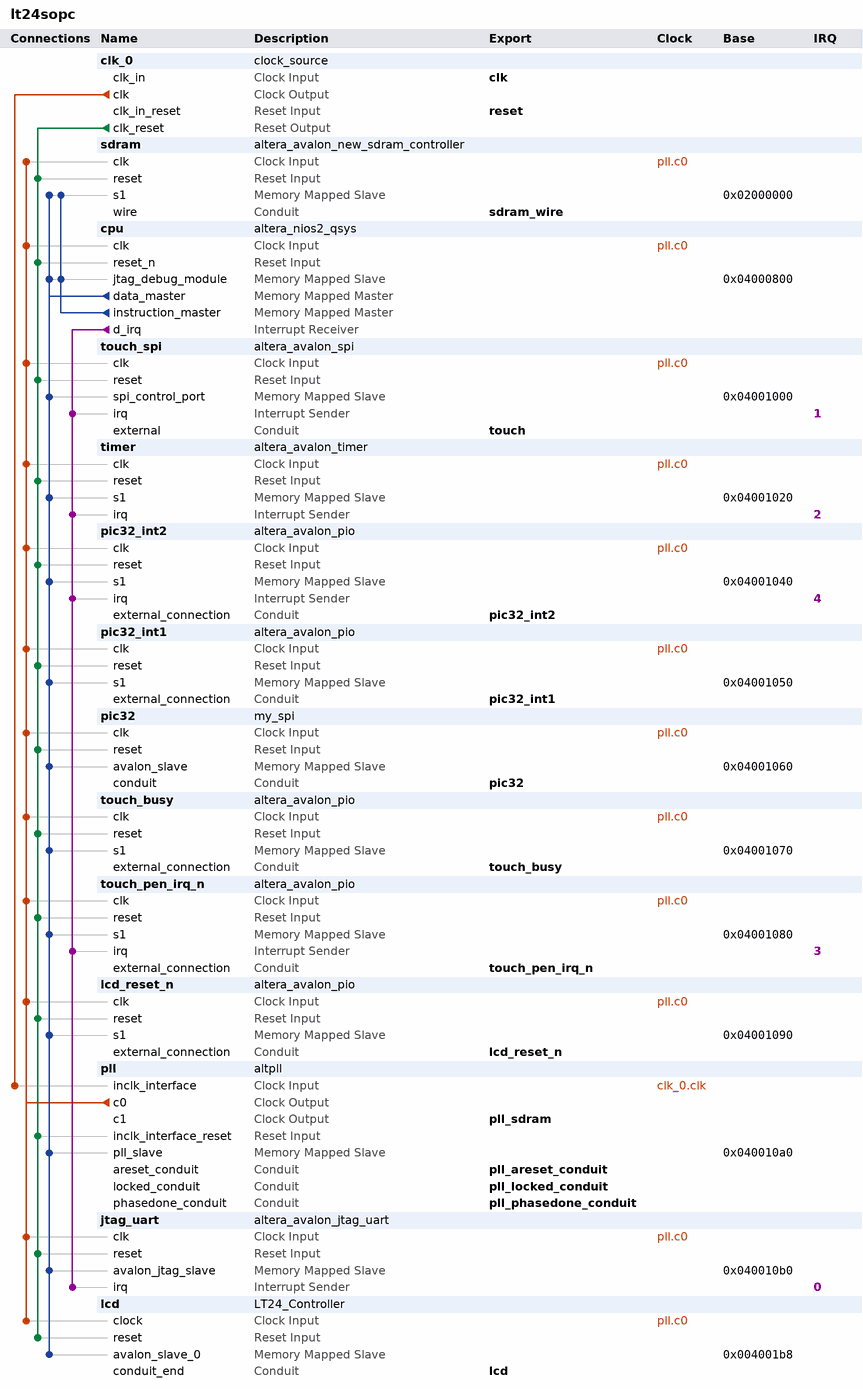
[diagram p0: system contents]
# Platform Designer (Qsys) system lt24sopc, Cyclone IV E EP4CE22F17C6
# Parameters at their usual value, and those the tool derives, are not listed.
package require -exact qsys 13.1
create_system lt24sopc
set_project_property DEVICE_FAMILY {Cyclone IV E}
set_project_property DEVICE EP4CE22F17C6

add_instance clk_0 clock_source 13.1
set_instance_parameter_value clk_0 clockFrequency 50000000

add_instance sdram altera_avalon_new_sdram_controller 13.1
set_instance_parameter_value sdram TAC 5.5
set_instance_parameter_value sdram TRCD 20.0
set_instance_parameter_value sdram TRP 20.0
set_instance_parameter_value sdram casLatency 3
set_instance_parameter_value sdram columnWidth 9
set_instance_parameter_value sdram dataWidth 16
set_instance_parameter_value sdram generateSimulationModel false
set_instance_parameter_value sdram model single_Micron_MT48LC4M32B2_7_chip
set_instance_parameter_value sdram numberOfBanks 4
set_instance_parameter_value sdram numberOfChipSelects 1
set_instance_parameter_value sdram powerUpDelay 100.0
set_instance_parameter_value sdram refreshPeriod 15.625
set_instance_parameter_value sdram rowWidth 13

add_instance cpu altera_nios2_qsys 13.1
set_instance_parameter_value cpu resetSlave sdram.s1
set_instance_parameter_value cpu mmu_TLBMissExcSlave None
set_instance_parameter_value cpu exceptionSlave sdram.s1
set_instance_parameter_value cpu breakSlave cpu.jtag_debug_module
set_instance_parameter_value cpu impl Fast
set_instance_parameter_value cpu icache_size 4096

add_instance touch_spi altera_avalon_spi 13.1
set_instance_parameter_value touch_spi clockPolarity 0
set_instance_parameter_value touch_spi dataWidth 8
set_instance_parameter_value touch_spi masterSPI true
set_instance_parameter_value touch_spi numberOfSlaves 1
set_instance_parameter_value touch_spi targetClockRate 32000

add_instance timer altera_avalon_timer 13.1
set_instance_parameter_value timer period 1
set_instance_parameter_value timer periodUnits MSEC

add_instance pic32_int2 altera_avalon_pio 13.1
set_instance_parameter_value pic32_int2 bitClearingEdgeCapReg true
set_instance_parameter_value pic32_int2 captureEdge true
set_instance_parameter_value pic32_int2 direction Input
set_instance_parameter_value pic32_int2 generateIRQ true
set_instance_parameter_value pic32_int2 irqType EDGE
set_instance_parameter_value pic32_int2 width 1

add_instance pic32_int1 altera_avalon_pio 13.1
set_instance_parameter_value pic32_int1 direction Output
set_instance_parameter_value pic32_int1 width 1

add_instance pic32 my_spi 1.0

add_instance touch_busy altera_avalon_pio 13.1
set_instance_parameter_value touch_busy direction Input
set_instance_parameter_value touch_busy width 1

add_instance touch_pen_irq_n altera_avalon_pio 13.1
set_instance_parameter_value touch_pen_irq_n captureEdge true
set_instance_parameter_value touch_pen_irq_n direction Input
set_instance_parameter_value touch_pen_irq_n edgeType FALLING
set_instance_parameter_value touch_pen_irq_n generateIRQ true
set_instance_parameter_value touch_pen_irq_n irqType EDGE
set_instance_parameter_value touch_pen_irq_n width 1

add_instance lcd_reset_n altera_avalon_pio 13.1
set_instance_parameter_value lcd_reset_n direction Output
set_instance_parameter_value lcd_reset_n width 1

add_instance pll altpll 13.1
set_instance_parameter_value pll INCLK0_INPUT_FREQUENCY 20000
set_instance_parameter_value pll CLK0_MULTIPLY_BY 2
set_instance_parameter_value pll CLK1_MULTIPLY_BY 2
set_instance_parameter_value pll CLK0_DIVIDE_BY 1
set_instance_parameter_value pll CLK1_DIVIDE_BY 1
set_instance_parameter_value pll CLK1_PHASE_SHIFT -3000
set_instance_parameter_value pll CLK1_DUTY_CYCLE 50
set_instance_parameter_value pll PORT_clk1 PORT_USED
set_instance_parameter_value pll PORT_clk2 PORT_UNUSED
set_instance_parameter_value pll PORT_clk3 PORT_UNUSED
set_instance_parameter_value pll PORT_ARESET PORT_UNUSED
set_instance_parameter_value pll PORT_LOCKED PORT_UNUSED

add_instance jtag_uart altera_avalon_jtag_uart 13.1
set_instance_parameter_value jtag_uart simInteractiveOptions NO_INTERACTIVE_WINDOWS

add_instance lcd LT24_Controller 1.0

# connections
add_connection clk_0.clk pll.inclk_interface clock
add_connection pll.c0 cpu.clk clock
add_connection pll.c0 jtag_uart.clk clock
add_connection pll.c0 lcd.clock clock
add_connection pll.c0 lcd_reset_n.clk clock
add_connection pll.c0 pic32.clk clock
add_connection pll.c0 pic32_int1.clk clock
add_connection pll.c0 pic32_int2.clk clock
add_connection pll.c0 sdram.clk clock
add_connection pll.c0 timer.clk clock
add_connection pll.c0 touch_busy.clk clock
add_connection pll.c0 touch_pen_irq_n.clk clock
add_connection pll.c0 touch_spi.clk clock
add_connection clk_0.clk_reset cpu.reset_n reset
add_connection clk_0.clk_reset jtag_uart.reset reset
add_connection clk_0.clk_reset lcd.reset reset
add_connection clk_0.clk_reset lcd_reset_n.reset reset
add_connection clk_0.clk_reset pic32.reset reset
add_connection clk_0.clk_reset pic32_int1.reset reset
add_connection clk_0.clk_reset pic32_int2.reset reset
add_connection clk_0.clk_reset pll.inclk_interface_reset reset
add_connection clk_0.clk_reset sdram.reset reset
add_connection clk_0.clk_reset timer.reset reset
add_connection clk_0.clk_reset touch_busy.reset reset
add_connection clk_0.clk_reset touch_pen_irq_n.reset reset
add_connection clk_0.clk_reset touch_spi.reset reset
add_connection cpu.data_master cpu.jtag_debug_module avalon
set_connection_parameter_value cpu.data_master/cpu.jtag_debug_module baseAddress 0x04000800
add_connection cpu.data_master jtag_uart.avalon_jtag_slave avalon
set_connection_parameter_value cpu.data_master/jtag_uart.avalon_jtag_slave baseAddress 0x040010b0
add_connection cpu.data_master lcd.avalon_slave_0 avalon
set_connection_parameter_value cpu.data_master/lcd.avalon_slave_0 baseAddress 0x004001b8
add_connection cpu.data_master lcd_reset_n.s1 avalon
set_connection_parameter_value cpu.data_master/lcd_reset_n.s1 baseAddress 0x04001090
add_connection cpu.data_master pic32.avalon_slave avalon
set_connection_parameter_value cpu.data_master/pic32.avalon_slave baseAddress 0x04001060
add_connection cpu.data_master pic32_int1.s1 avalon
set_connection_parameter_value cpu.data_master/pic32_int1.s1 baseAddress 0x04001050
add_connection cpu.data_master pic32_int2.s1 avalon
set_connection_parameter_value cpu.data_master/pic32_int2.s1 baseAddress 0x04001040
add_connection cpu.data_master pll.pll_slave avalon
set_connection_parameter_value cpu.data_master/pll.pll_slave baseAddress 0x040010a0
add_connection cpu.data_master sdram.s1 avalon
set_connection_parameter_value cpu.data_master/sdram.s1 baseAddress 0x02000000
add_connection cpu.data_master timer.s1 avalon
set_connection_parameter_value cpu.data_master/timer.s1 baseAddress 0x04001020
add_connection cpu.data_master touch_busy.s1 avalon
set_connection_parameter_value cpu.data_master/touch_busy.s1 baseAddress 0x04001070
add_connection cpu.data_master touch_pen_irq_n.s1 avalon
set_connection_parameter_value cpu.data_master/touch_pen_irq_n.s1 baseAddress 0x04001080
add_connection cpu.data_master touch_spi.spi_control_port avalon
set_connection_parameter_value cpu.data_master/touch_spi.spi_control_port baseAddress 0x04001000
add_connection cpu.instruction_master cpu.jtag_debug_module avalon
set_connection_parameter_value cpu.instruction_master/cpu.jtag_debug_module baseAddress 0x04000800
add_connection cpu.instruction_master sdram.s1 avalon
set_connection_parameter_value cpu.instruction_master/sdram.s1 baseAddress 0x02000000
add_connection cpu.d_irq jtag_uart.irq interrupt
set_connection_parameter_value cpu.d_irq/jtag_uart.irq irqNumber 0
add_connection cpu.d_irq pic32_int2.irq interrupt
set_connection_parameter_value cpu.d_irq/pic32_int2.irq irqNumber 4
add_connection cpu.d_irq timer.irq interrupt
set_connection_parameter_value cpu.d_irq/timer.irq irqNumber 2
add_connection cpu.d_irq touch_pen_irq_n.irq interrupt
set_connection_parameter_value cpu.d_irq/touch_pen_irq_n.irq irqNumber 3
add_connection cpu.d_irq touch_spi.irq interrupt
set_connection_parameter_value cpu.d_irq/touch_spi.irq irqNumber 1

# exported interfaces
add_interface clk clock sink
set_interface_property clk EXPORT_OF clk_0.clk_in
add_interface reset reset sink
set_interface_property reset EXPORT_OF clk_0.clk_in_reset
add_interface pll_areset_conduit conduit end
set_interface_property pll_areset_conduit EXPORT_OF pll.areset_conduit
add_interface pll_locked_conduit conduit end
set_interface_property pll_locked_conduit EXPORT_OF pll.locked_conduit
add_interface pll_phasedone_conduit conduit end
set_interface_property pll_phasedone_conduit EXPORT_OF pll.phasedone_conduit
add_interface pll_sdram clock source
set_interface_property pll_sdram EXPORT_OF pll.c1
add_interface sdram_wire conduit end
set_interface_property sdram_wire EXPORT_OF sdram.wire
add_interface lcd_reset_n conduit end
set_interface_property lcd_reset_n EXPORT_OF lcd_reset_n.external_connection
add_interface touch conduit end
set_interface_property touch EXPORT_OF touch_spi.external
add_interface touch_pen_irq_n conduit end
set_interface_property touch_pen_irq_n EXPORT_OF touch_pen_irq_n.external_connection
add_interface touch_busy conduit end
set_interface_property touch_busy EXPORT_OF touch_busy.external_connection
add_interface pic32 conduit end
set_interface_property pic32 EXPORT_OF pic32.conduit
add_interface pic32_int1 conduit end
set_interface_property pic32_int1 EXPORT_OF pic32_int1.external_connection
add_interface pic32_int2 conduit end
set_interface_property pic32_int2 EXPORT_OF pic32_int2.external_connection
add_interface lcd conduit end
set_interface_property lcd EXPORT_OF lcd.conduit_end

set_interconnect_requirement {$system} qsys_mm.clockCrossingAdapter HANDSHAKE
set_interconnect_requirement {$system} qsys_mm.maxAdditionalLatency 1
set_interconnect_requirement {$system} qsys_mm.insertDefaultSlave false

save_system lt24sopc.qsys
